# EAGLE schematic duckypad (EAGLE 9.6.2)
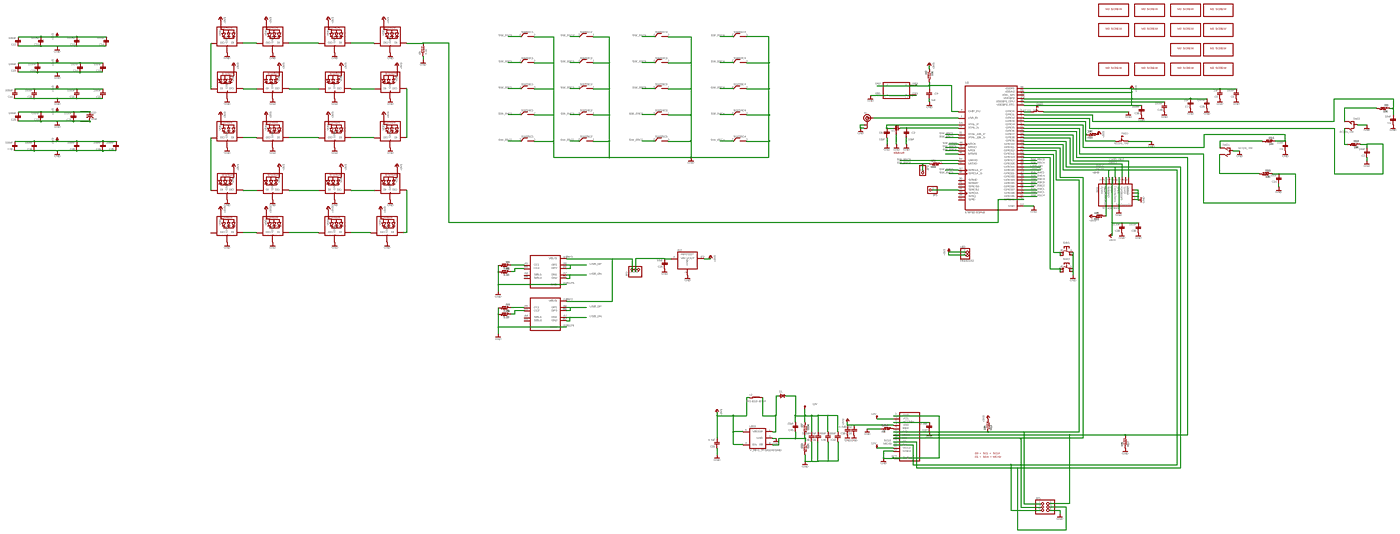
[diagram p0: schematic, sheet 1, overview]
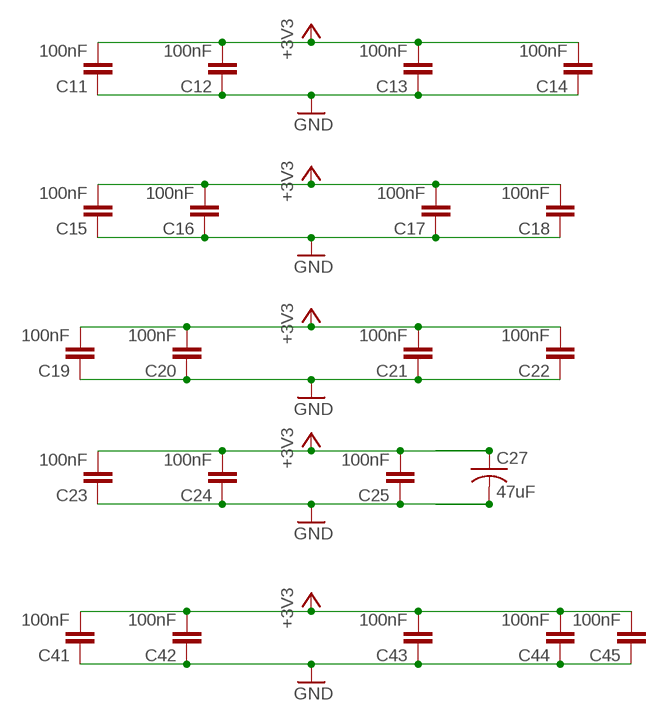
[diagram p1: schematic, sheet 1, part 1 of 4]
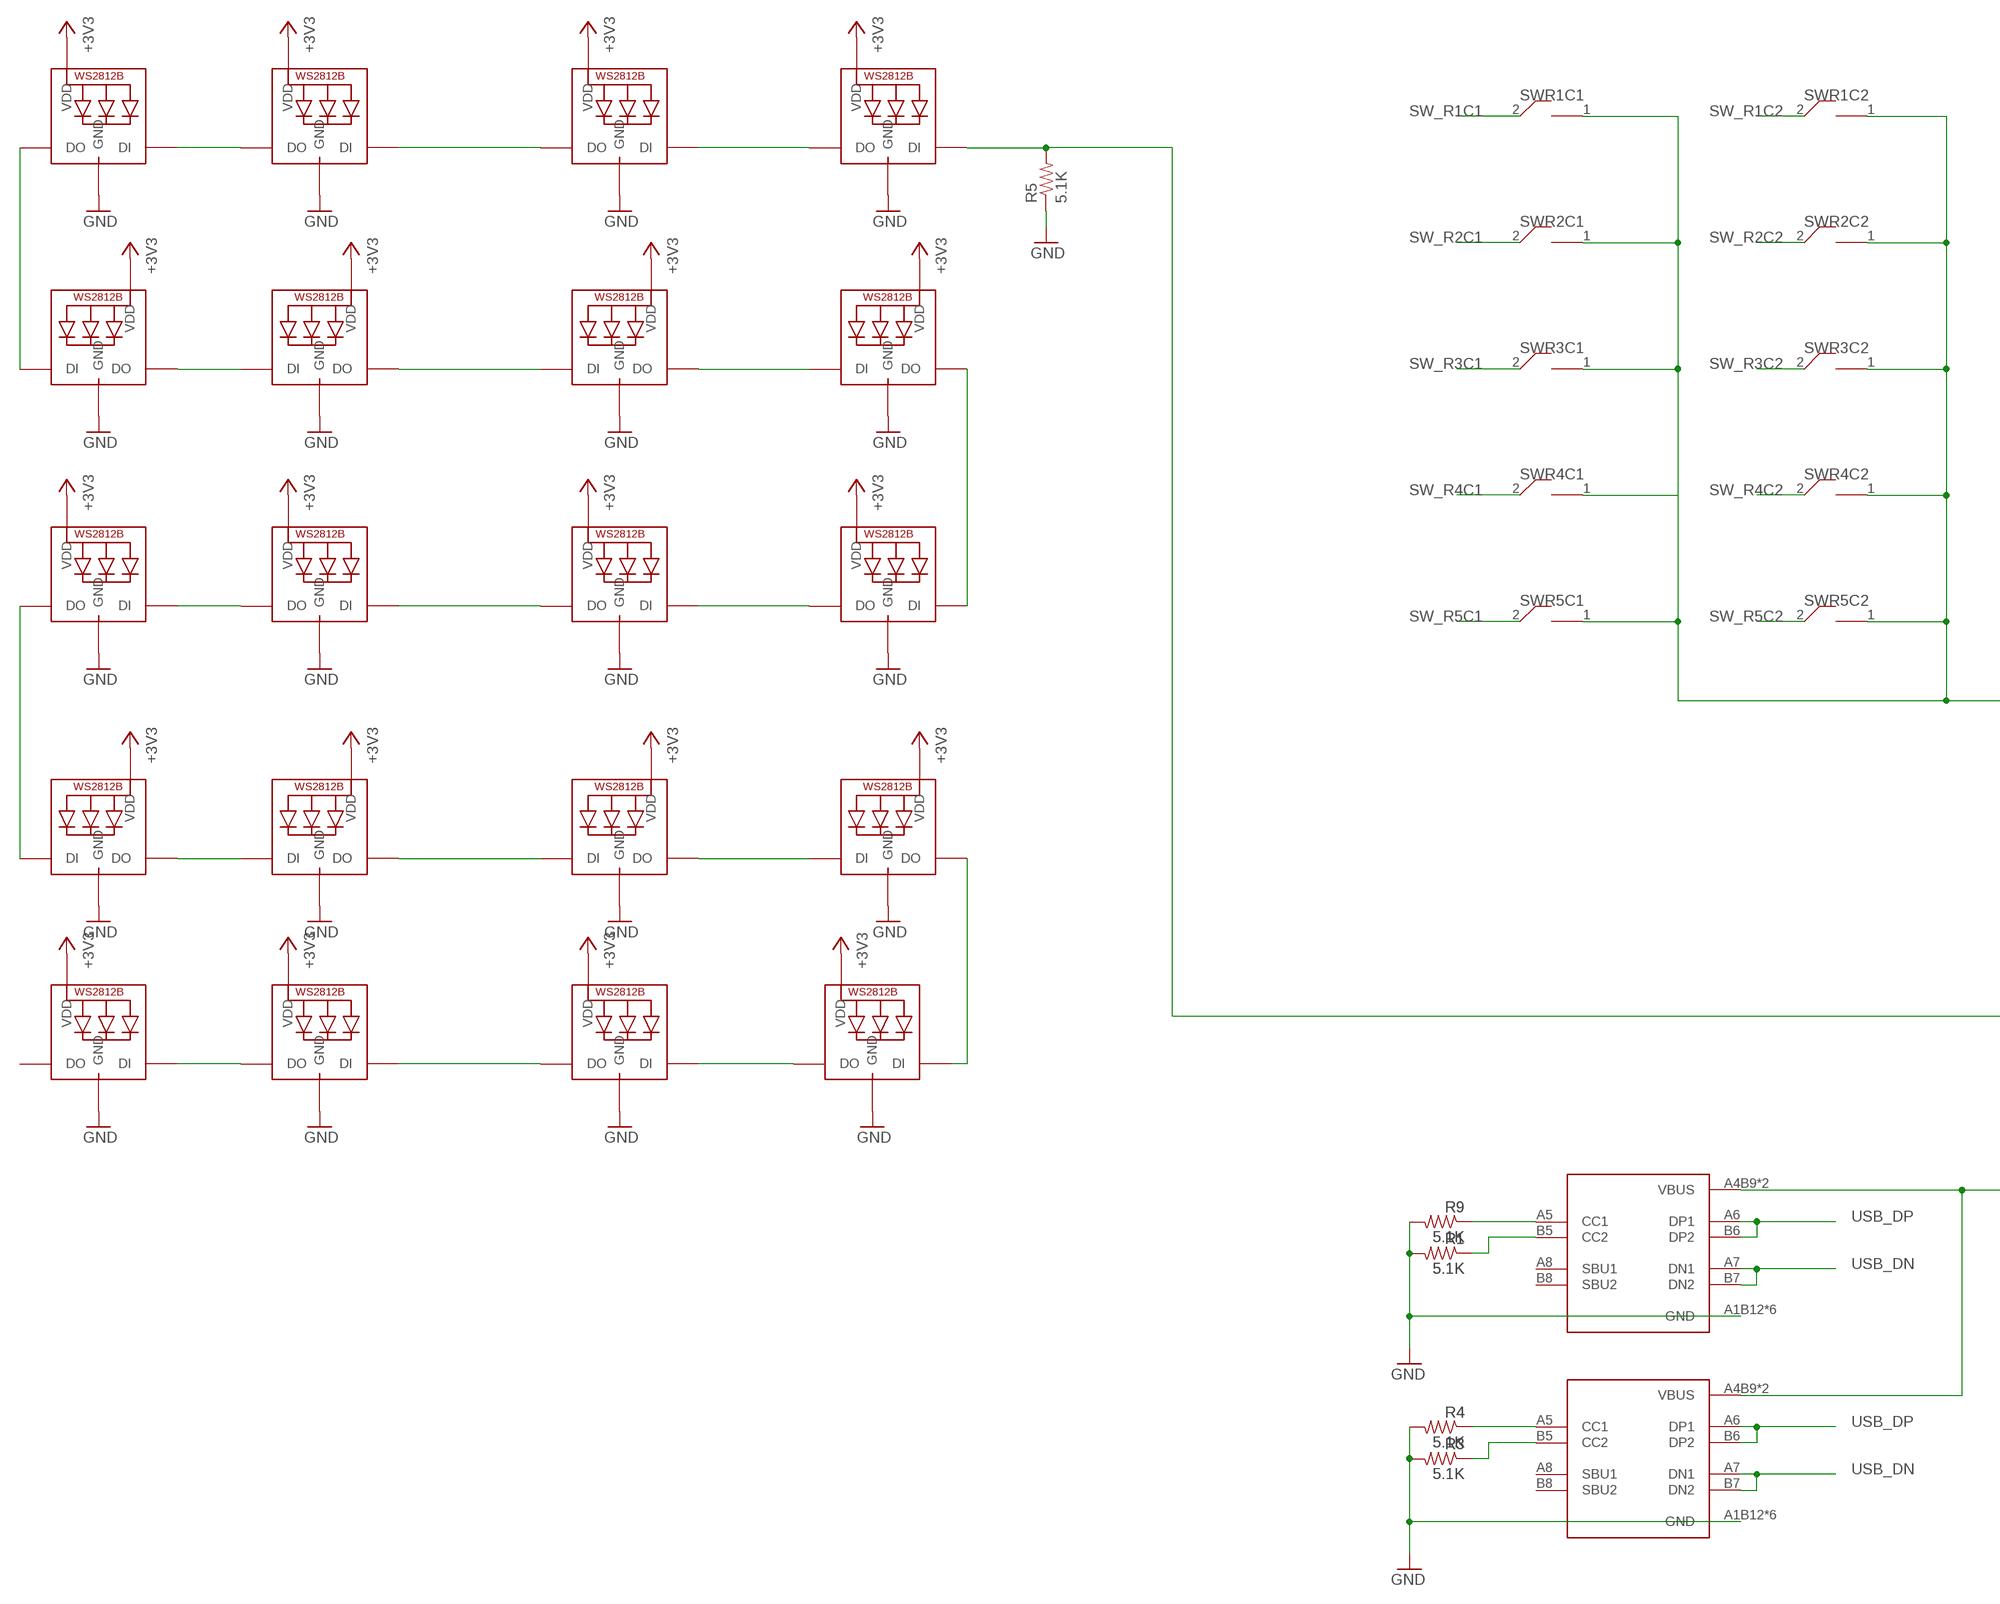
[diagram p2: schematic, sheet 1, part 2 of 4]
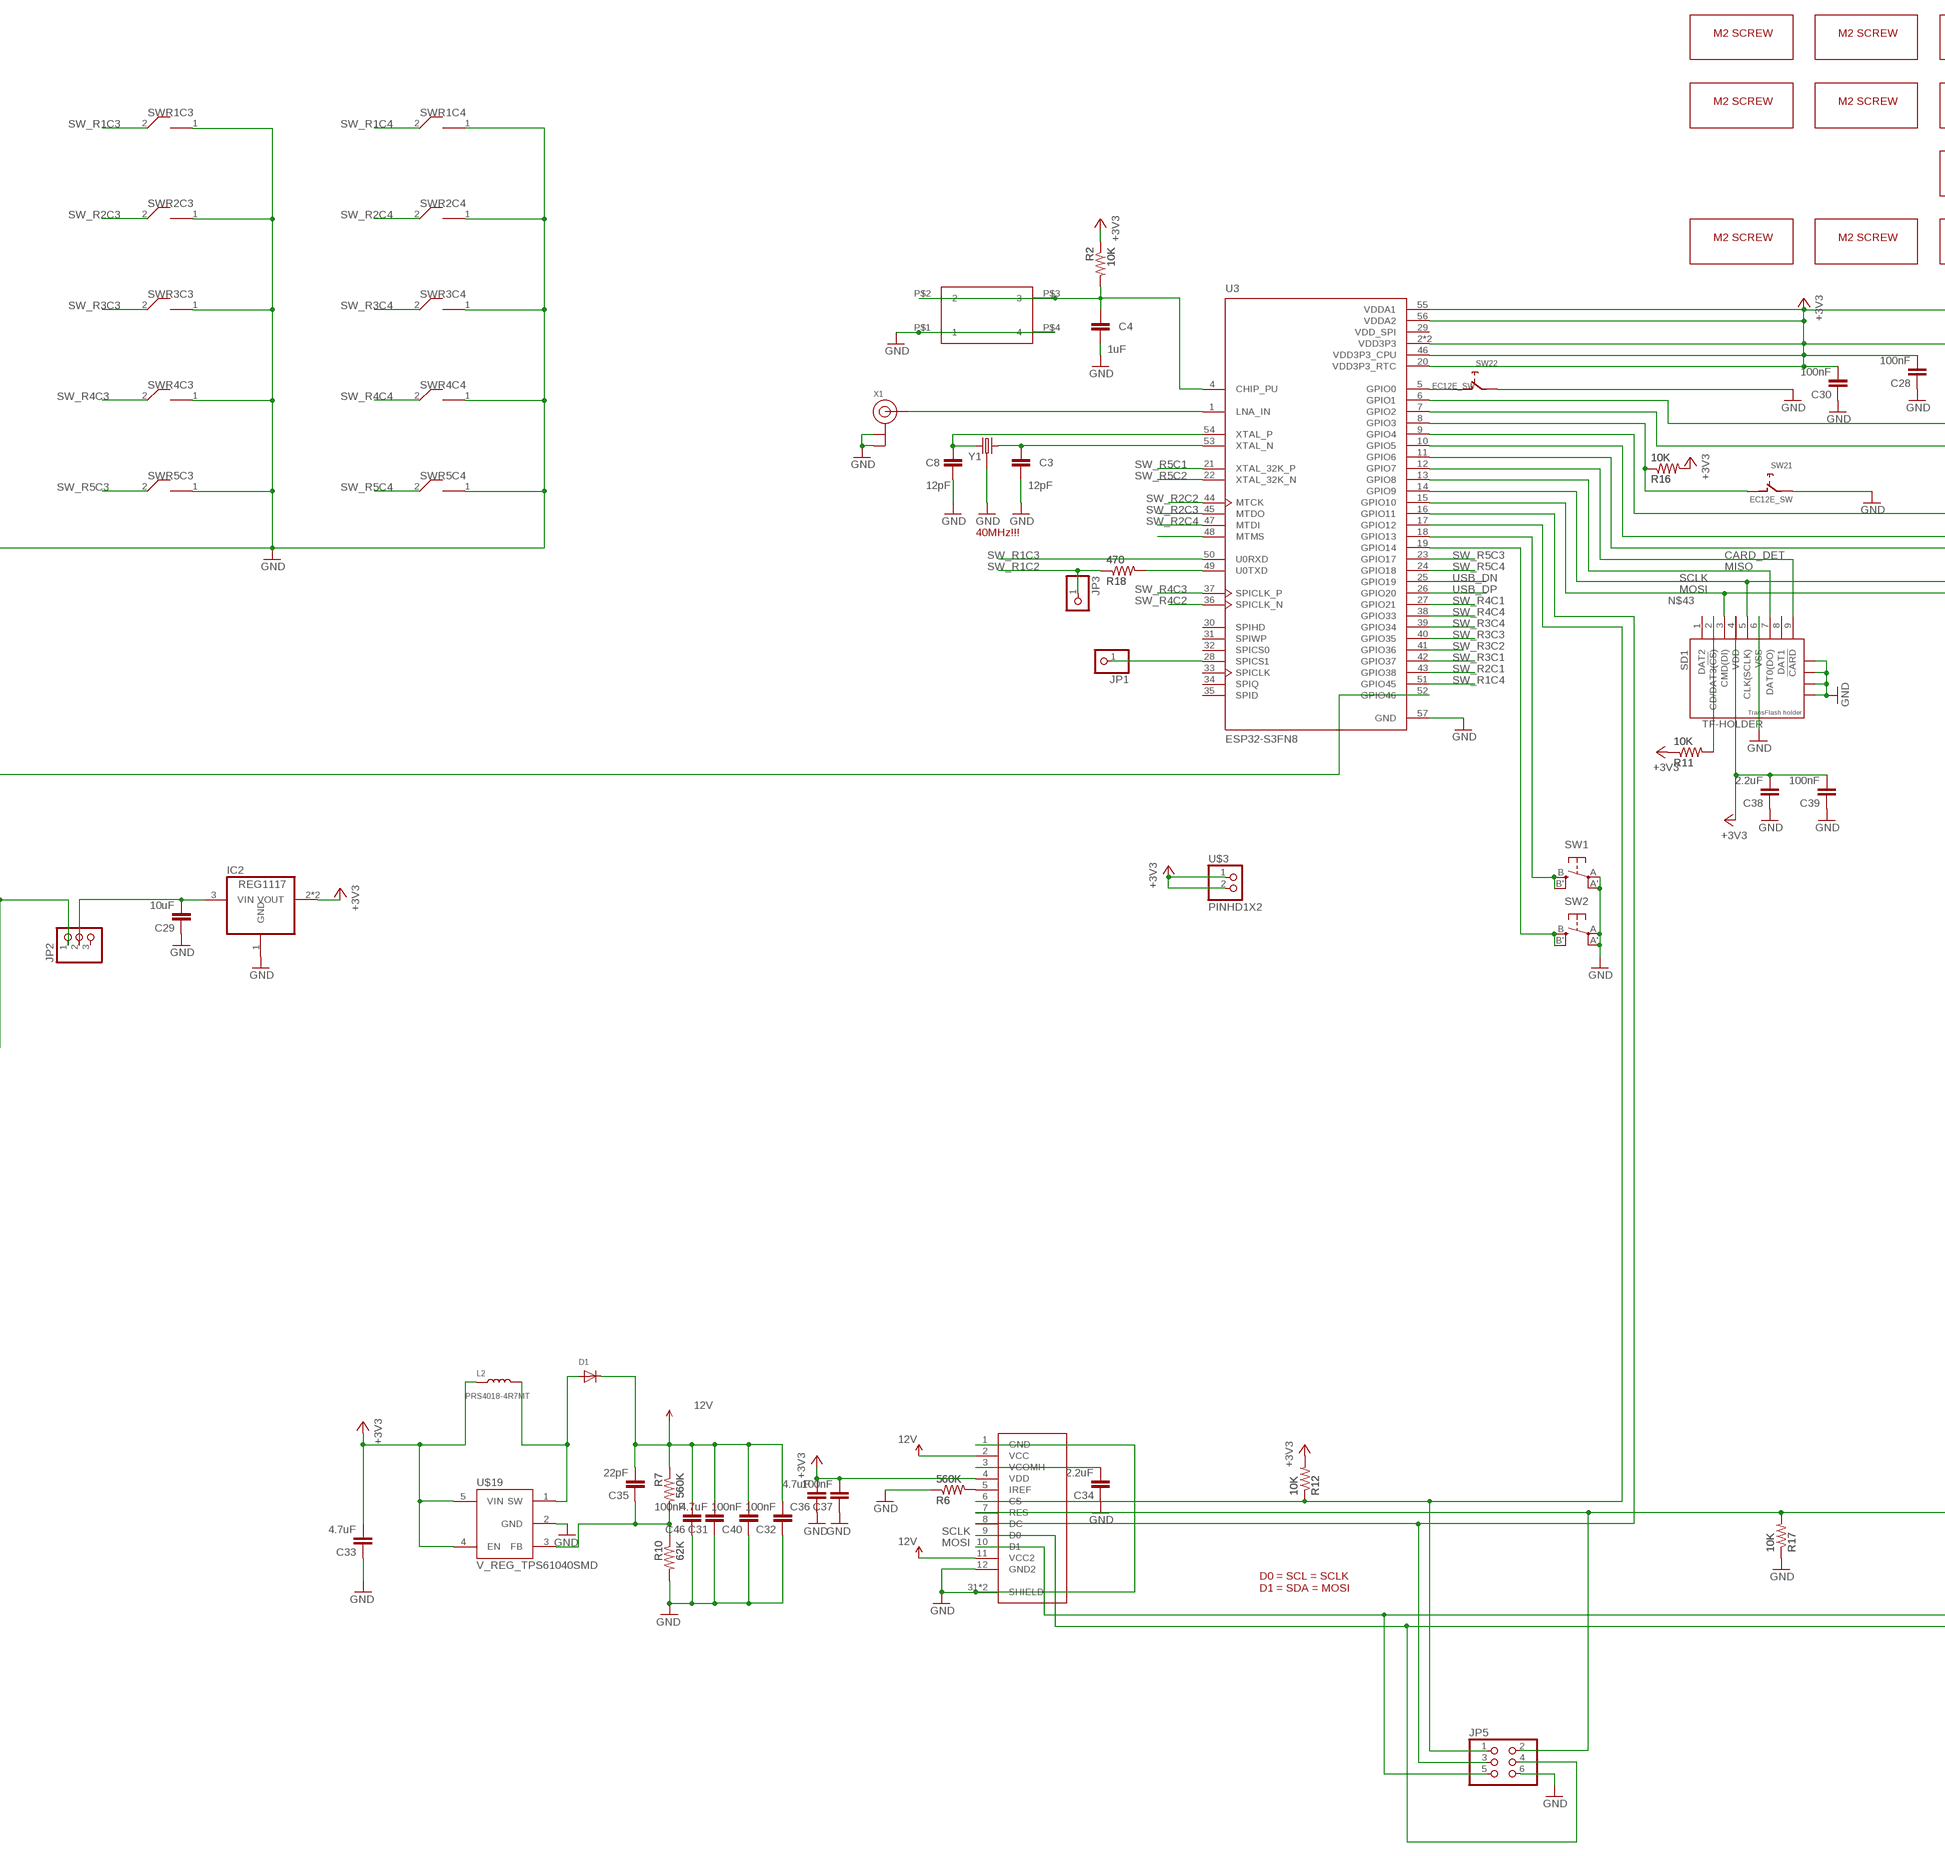
[diagram p3: schematic, sheet 1, part 3 of 4]
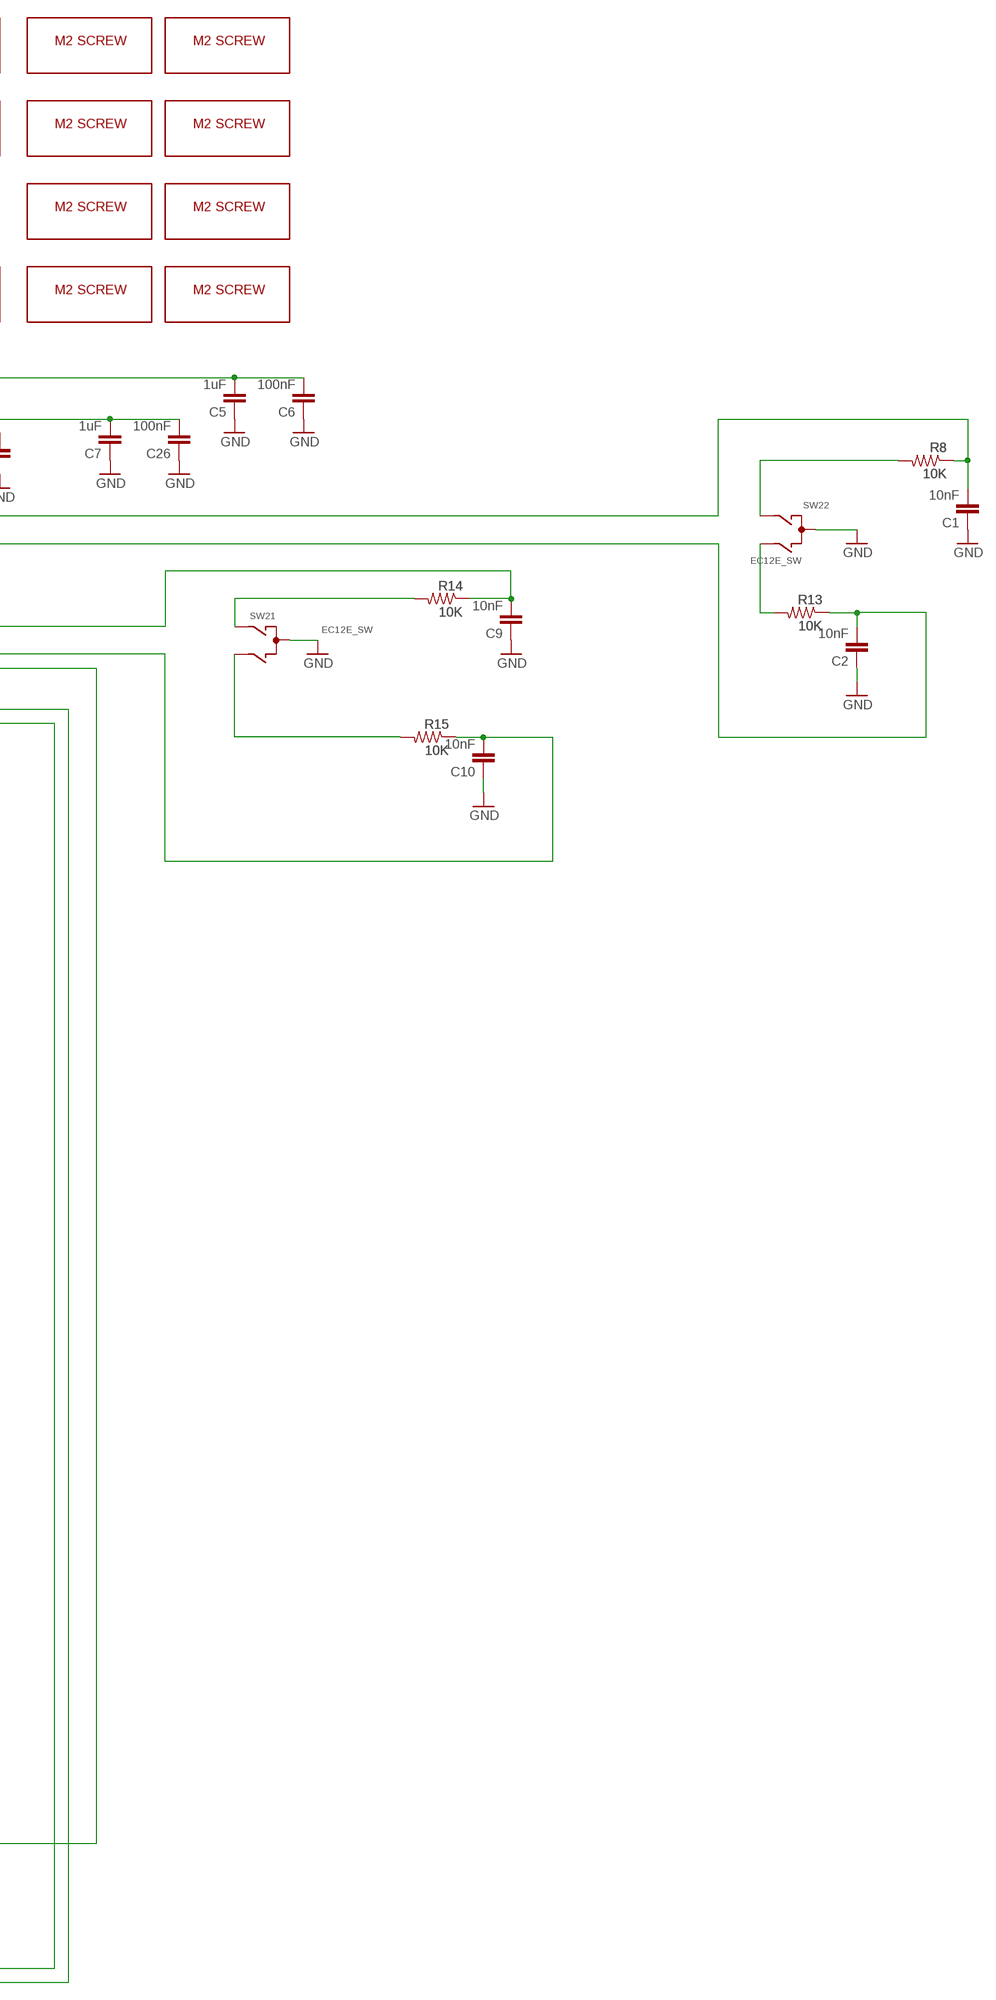
[diagram p4: schematic, sheet 1, part 4 of 4]

## Parts
C1  10nF  CAP0805  [0805]
C2  10nF  CAP0805  [0805]
C3  12pF  CAP0805  [0805]
C4  1uF  CAP0805  [0805]
C5  1uF  CAP0805  [0805]
C6  100nF  CAP0805  [0805]
C7  1uF  CAP0805  [0805]
C8  12pF  CAP0805  [0805]
C9  10nF  CAP0805  [0805]
C10  10nF  CAP0805  [0805]
C11  100nF  CAP0805  [0805]
C12  100nF  CAP0805  [0805]
C13  100nF  CAP0805  [0805]
C14  100nF  CAP0805  [0805]
C15  100nF  CAP0805  [0805]
C16  100nF  CAP0805  [0805]
C17  100nF  CAP0805  [0805]
C18  100nF  CAP0805  [0805]
C19  100nF  CAP0805  [0805]
C20  100nF  CAP0805  [0805]
C21  100nF  CAP0805  [0805]
C22  100nF  CAP0805  [0805]
C23  100nF  CAP0805  [0805]
C24  100nF  CAP0805  [0805]
C25  100nF  CAP0805  [0805]
C26  100nF  CAP0805  [0805]
C27  47uF  C-USC1210  [C1210]
C28  100nF  CAP0805  [0805]
C29  10uF  CAP0805  [0805]
C30  100nF  CAP0805  [0805]
C31  4.7uF  CAP0805  [0805]
C32  100nF  CAP0805  [0805]
C33  4.7uF  CAP0805  [0805]
C34  2.2uF  CAP0805  [0805]
C35  22pF  CAP0805  [0805]
C36  4.7uF  CAP0805  [0805]
C37  100nF  CAP0805  [0805]
C38  2.2uF  CAP0805  [0805]
C39  100nF  CAP0805  [0805]
C40  100nF  CAP0805  [0805]
C41  100nF  CAP0805  [0805]
C42  100nF  CAP0805  [0805]
C43  100nF  CAP0805  [0805]
C44  100nF  CAP0805  [0805]
C45  100nF  CAP0805  [0805]
C46  100nF  CAP0805  [0805]
D1  DIODESOD-123  [SOD-123]
IC2  REG1117  [SOT223]
JP1  PINHD-1X1CB  [1X01-CLEANBIG]
JP2  PINHD-1X3CB  [1X03-CLEANBIG]
JP3  PINHD-1X1CB  [1X01-CLEANBIG]
JP5  PINHD-2X3  [2X03]
L2  PRS4018-4R7MT  L-4030  [L4030]
LED_R1C1  WS2812B  [REVERSE_MNT]
LED_R1C2  WS2812B  [REVERSE_MNT]
LED_R1C3  WS2812B  [REVERSE_MNT]
LED_R1C4  WS2812B  [REVERSE_MNT]
LED_R2C1  WS2812B  [REVERSE_MNT]
LED_R2C2  WS2812B  [REVERSE_MNT]
LED_R2C3  WS2812B  [REVERSE_MNT]
LED_R2C4  WS2812B  [REVERSE_MNT]
LED_R3C1  WS2812B  [REVERSE_MNT]
LED_R3C2  WS2812B  [REVERSE_MNT]
LED_R3C3  WS2812B  [REVERSE_MNT]
LED_R3C4  WS2812B  [REVERSE_MNT]
LED_R4C1  WS2812B  [REVERSE_MNT]
LED_R4C2  WS2812B  [REVERSE_MNT]
LED_R4C3  WS2812B  [REVERSE_MNT]
LED_R4C4  WS2812B  [REVERSE_MNT]
LED_R5C1  WS2812B  [REVERSE_MNT]
LED_R5C2  WS2812B  [REVERSE_MNT]
LED_R5C3  WS2812B  [REVERSE_MNT]
LED_R5C4  WS2812B  [REVERSE_MNT]
R1  5.1K  RESISTOR0805-RES  [0805]
R2  10K  RESISTOR0805-RES  [0805]
R3  5.1K  RESISTOR0805-RES  [0805]
R4  5.1K  RESISTOR0805-RES  [0805]
R5  5.1K  RESISTOR0805-RES  [0805]
R6  560K  RESISTOR0805-RES  [0805]
R7  560K  RESISTOR0805-RES  [0805]
R8  10K  RESISTOR0805-RES  [0805]
R9  5.1K  RESISTOR0805-RES  [0805]
R10  62K  RESISTOR0805-RES  [0805]
R11  10K  RESISTOR0805-RES  [0805]
R12  10K  RESISTOR0805-RES  [0805]
R13  10K  RESISTOR0805-RES  [0805]
R14  10K  RESISTOR0805-RES  [0805]
R15  10K  RESISTOR0805-RES  [0805]
R16  10K  RESISTOR0805-RES  [0805]
R17  10K  RESISTOR0805-RES  [0805]
R18  470  RESISTOR0805-RES  [0805]
SD1  TF-HOLDER  [TF-PULL]
SW1  SPST_TACT-EVQQ2  [EVQ-Q2]
SW2  SPST_TACT-EVQQ2  [EVQ-Q2]
SW3  324_SW324_SWITCH_FOOT_HOLE  [342_SWICH_FOOT_HOLE]
SW21  EC12E_SW  [ALPS_EC12E_SW]
SW22  EC12E_SW  [ALPS_EC12E_SW]
SWR1C1  KAILH_SWITCH_SOCKET_KAILH_SWITCH_SOCKET  [KAILH_SWITCH_SOCKET_SWITCH_SOCKET]
SWR1C2  KAILH_SWITCH_SOCKET_KAILH_SWITCH_SOCKET  [KAILH_SWITCH_SOCKET_SWITCH_SOCKET]
SWR1C3  KAILH_SWITCH_SOCKET_KAILH_SWITCH_SOCKET  [KAILH_SWITCH_SOCKET_SWITCH_SOCKET]
SWR1C4  KAILH_SWITCH_SOCKET_KAILH_SWITCH_SOCKET  [KAILH_SWITCH_SOCKET_SWITCH_SOCKET]
SWR2C1  KAILH_SWITCH_SOCKET_KAILH_SWITCH_SOCKET  [KAILH_SWITCH_SOCKET_SWITCH_SOCKET]
SWR2C2  KAILH_SWITCH_SOCKET_KAILH_SWITCH_SOCKET  [KAILH_SWITCH_SOCKET_SWITCH_SOCKET]
SWR2C3  KAILH_SWITCH_SOCKET_KAILH_SWITCH_SOCKET  [KAILH_SWITCH_SOCKET_SWITCH_SOCKET]
SWR2C4  KAILH_SWITCH_SOCKET_KAILH_SWITCH_SOCKET  [KAILH_SWITCH_SOCKET_SWITCH_SOCKET]
SWR3C1  KAILH_SWITCH_SOCKET_KAILH_SWITCH_SOCKET  [KAILH_SWITCH_SOCKET_SWITCH_SOCKET]
SWR3C2  KAILH_SWITCH_SOCKET_KAILH_SWITCH_SOCKET  [KAILH_SWITCH_SOCKET_SWITCH_SOCKET]
SWR3C3  KAILH_SWITCH_SOCKET_KAILH_SWITCH_SOCKET  [KAILH_SWITCH_SOCKET_SWITCH_SOCKET]
SWR3C4  KAILH_SWITCH_SOCKET_KAILH_SWITCH_SOCKET  [KAILH_SWITCH_SOCKET_SWITCH_SOCKET]
SWR4C1  KAILH_SWITCH_SOCKET_KAILH_SWITCH_SOCKET  [KAILH_SWITCH_SOCKET_SWITCH_SOCKET]
SWR4C2  KAILH_SWITCH_SOCKET_KAILH_SWITCH_SOCKET  [KAILH_SWITCH_SOCKET_SWITCH_SOCKET]
SWR4C3  KAILH_SWITCH_SOCKET_KAILH_SWITCH_SOCKET  [KAILH_SWITCH_SOCKET_SWITCH_SOCKET]
SWR4C4  KAILH_SWITCH_SOCKET_KAILH_SWITCH_SOCKET  [KAILH_SWITCH_SOCKET_SWITCH_SOCKET]
SWR5C1  KAILH_SWITCH_SOCKET_KAILH_SWITCH_SOCKET  [KAILH_SWITCH_SOCKET_SWITCH_SOCKET]
SWR5C2  KAILH_SWITCH_SOCKET_KAILH_SWITCH_SOCKET  [KAILH_SWITCH_SOCKET_SWITCH_SOCKET]
SWR5C3  KAILH_SWITCH_SOCKET_KAILH_SWITCH_SOCKET  [KAILH_SWITCH_SOCKET_SWITCH_SOCKET]
SWR5C4  KAILH_SWITCH_SOCKET_KAILH_SWITCH_SOCKET  [KAILH_SWITCH_SOCKET_SWITCH_SOCKET]
U1  USBC_16P  [USBC_16P_FOOT]
U2  USBC_16P  [USBC_16P_FOOT]
U3  ESP32-S3FN8  [QFN40P700X700X90-57N]
U$2  OLED128  [LUL_UG-2864HSWEG01_1.3_WRAPAROUND]
U$3  PINHD1X2  [1X02]
U$7  M2_SCREW_DEV  [M2_SCREW_FOOT]
U$8  M2_SCREW_DEV  [M2_SCREW_FOOT]
U$9  M2_SCREW_DEV  [M2_SCREW_FOOT]
U$10  M2_SCREW_DEV  [M2_SCREW_FOOT]
U$11  M2_SCREW_DEV  [M2_SCREW_FOOT]
U$12  M2_SCREW_DEV  [M2_SCREW_FOOT]
U$13  M2_SCREW_DEV  [M2_SCREW_FOOT]
U$14  M2_SCREW_DEV  [M2_SCREW_FOOT]
U$15  M2_SCREW_DEV  [M2_SCREW_FOOT]
U$16  M2_SCREW_DEV  [M2_SCREW_FOOT]
U$17  M2_SCREW_DEV  [M2_SCREW_FOOT]
U$19  V_REG_TPS61040SMD  [SOT23-5]
U$20  M2_SCREW_DEV  [M2_SCREW_FOOT]
U$21  M2_SCREW_DEV  [M2_SCREW_FOOT]
U$22  M2_SCREW_DEV  [M2_SCREW_FOOT]
X1  ANTENNA_U.FL  [U.FL]
Y1  16MHz_12pF  CRYSTAL-26MHZSMD-3.2X2.5  [CRYSTAL-SMD-3.2X2.5MM]

## Nets
12V: C31.2 C32.2 C35.2 C40.2 C46.2 D1.C R7.1 U$2.2(VCC) U$2.11(VCC2)
+3V3: C5.2 C6.2 C7.2 C11.2 C12.2 C13.2 C14.2 C15.2 C16.2 C17.2 C18.2 C19.2 C20.2 C21.2 C22.2 C23.2 C24.2 C25.2 C26.2 C27.1 C28.2 C30.2 C33.2 C36.2 C37.2 C38.2 C39.2 C41.2 C42.2 C43.2 C44.2 C45.2 IC2.2(VOUT) IC2.4(VOUT) L2.1 LED_R1C1.VDD LED_R1C2.VDD LED_R1C3.VDD LED_R1C4.VDD LED_R2C1.VDD LED_R2C2.VDD LED_R2C3.VDD LED_R2C4.VDD LED_R3C1.VDD LED_R3C2.VDD LED_R3C3.VDD LED_R3C4.VDD LED_R4C1.VDD LED_R4C2.VDD LED_R4C3.VDD LED_R4C4.VDD LED_R5C1.VDD LED_R5C2.VDD LED_R5C3.VDD LED_R5C4.VDD R2.1 R11.1 R12.2 R16.2 SD1.4(VDD) U3.2(VDD3P3) U3.3(VDD3P3) U3.20(VDD3P3_RTC) U3.46(VDD3P3_CPU) U3.55(VDDA1) U3.56(VDDA2) U$2.4(VDD) U$3.1 U$3.2 U$19.4(EN) U$19.5(VIN)
CARD_DET: SD1.9(!CARD) U3.12(GPIO7)
DC: JP5.3 U3.16(GPIO11) U$2.8(DC)
GND: C1.1 C2.1 C3.2 C4.2 C5.1 C6.1 C7.1 C8.2 C9.1 C10.1 C11.1 C12.1 C13.1 C14.1 C15.1 C16.1 C17.1 C18.1 C19.1 C20.1 C21.1 C22.1 C23.1 C24.1 C25.1 C26.1 C27.2 C28.1 C29.1 C30.1 C31.1 C32.1 C33.1 C34.1 C36.1 C37.1 C38.1 C39.1 C40.1 C41.1 C42.1 C43.1 C44.1 C45.1 C46.1 IC2.1(GND) JP5.6 LED_R1C1.GND LED_R1C2.GND LED_R1C3.GND LED_R1C4.GND LED_R2C1.GND LED_R2C2.GND LED_R2C3.GND LED_R2C4.GND LED_R3C1.GND LED_R3C2.GND LED_R3C3.GND LED_R3C4.GND LED_R4C1.GND LED_R4C2.GND LED_R4C3.GND LED_R4C4.GND LED_R5C1.GND LED_R5C2.GND LED_R5C3.GND LED_R5C4.GND R1.2 R3.2 R4.2 R5.1 R6.1 R9.2 R10.2 R17.1 SD1.6(VSS) SD1.S1 SD1.S2 SD1.S3 SD1.S4 SW1.A'(P1) SW1.A(P) SW2.A'(P1) SW2.A(P) SW3.P$1 SW3.P$4 SW21.C SW21.E SW22.C SW22.E SWR1C1.1 SWR1C2.1 SWR1C3.1 SWR1C4.1 SWR2C1.1 SWR2C2.1 SWR2C3.1 SWR2C4.1 SWR3C1.1 SWR3C2.1 SWR3C3.1 SWR3C4.1 SWR4C1.1 SWR4C2.1 SWR4C3.1 SWR4C4.1 SWR5C1.1 SWR5C2.1 SWR5C3.1 SWR5C4.1 U1.A1B12(GND) U1.B11A12(GND) U1.P$13(GND) U1.P$14(GND) U1.P$15(GND) U1.P$16(GND) U2.A1B12(GND) U2.B11A12(GND) U2.P$13(GND) U2.P$14(GND) U2.P$15(GND) U2.P$16(GND) U3.57(GND) U$2.1(GND) U$2.12(GND2) U$2.31(SHIELD) U$2.32(SHIELD) U$19.2(GND) X1.1(GND) X1.2(GND) Y1.2 Y1.4
MISO: SD1.7(DAT0(DO)) U3.13(GPIO8)
MOSI: JP5.5 SD1.3(CMD(DI)) U3.15(GPIO10) U$2.10(D1)
N$1: JP2.1 U1.A4B9(VBUS) U1.B4A9(VBUS) U2.A4B9(VBUS) U2.B4A9(VBUS)
N$2: LED_R1C3.DIN(DI) LED_R1C4.DOUT(DO)
N$3: LED_R1C2.DIN(DI) LED_R1C3.DOUT(DO)
N$4: LED_R1C1.DIN(DI) LED_R1C2.DOUT(DO)
N$5: LED_R1C1.DOUT(DO) LED_R2C1.DIN(DI)
N$6: LED_R2C1.DOUT(DO) LED_R2C2.DIN(DI)
N$7: LED_R2C2.DOUT(DO) LED_R2C3.DIN(DI)
N$8: C34.2 U$2.3(VCOMH)
N$9: LED_R2C3.DOUT(DO) LED_R2C4.DIN(DI)
N$10: R6.2 U$2.5(IREF)
N$11: LED_R2C4.DOUT(DO) LED_R3C4.DIN(DI)
N$12: LED_R3C3.DIN(DI) LED_R3C4.DOUT(DO)
N$13: LED_R3C2.DIN(DI) LED_R3C3.DOUT(DO)
N$14: C9.2 R14.1 U3.9(GPIO4)
N$15: LED_R3C1.DIN(DI) LED_R3C2.DOUT(DO)
N$16: LED_R3C1.DOUT(DO) LED_R4C1.DIN(DI)
N$17: LED_R4C1.DOUT(DO) LED_R4C2.DIN(DI)
N$18: LED_R4C2.DOUT(DO) LED_R4C3.DIN(DI)
N$19: LED_R4C3.DOUT(DO) LED_R4C4.DIN(DI)
N$20: LED_R4C4.DOUT(DO) LED_R5C4.DIN(DI)
N$21: LED_R5C3.DIN(DI) LED_R5C4.DOUT(DO)
N$22: LED_R5C2.DIN(DI) LED_R5C3.DOUT(DO)
N$23: LED_R5C1.DIN(DI) LED_R5C2.DOUT(DO)
N$24: C8.1 U3.54(XTAL_P) Y1.1
N$25: C3.1 U3.53(XTAL_N) Y1.3
N$26: U3.1(LNA_IN) X1.3(SIGNAL)
N$27: JP1.1 U3.28(SPICS1)
N$28: R3.1 U1.B5(CC2)
N$29: LED_R1C4.DIN(DI) R5.2 U3.52(GPIO46)
N$30: R4.1 U1.A5(CC1)
N$31: R1.1 U2.B5(CC2)
N$32: C29.2 IC2.3(VIN) JP2.2
N$33: R9.1 U2.A5(CC1)
N$34: R8.2 SW22.A
N$35: R13.2 SW22.B
N$36: D1.A L2.2 U$19.1(SW)
N$37: SW22.D U3.5(GPIO0)
N$38: C1.2 R8.1 U3.6(GPIO1)
N$39: C35.1 R7.2 R10.1 U$19.3(FB)
N$40: C2.2 R13.1 U3.7(GPIO2)
N$41: R16.1 SW21.D U3.8(GPIO3)
N$42: R15.2 SW21.B
N$43: R11.2 SD1.2(CD/DAT3(!CS!))
N$44: R18.2 U3.49(U0TXD)
N$46: SW1.B'(S1) SW1.B(S) U3.18(GPIO13)
N$47: SW2.B'(S1) SW2.B(S) U3.19(GPIO14)
N$48: R14.2 SW21.A
N$49: C10.2 R15.1 U3.10(GPIO5)
OLED_CS: JP5.1 R12.1 U3.17(GPIO12) U$2.6(CS)
OLED_RESET: JP5.2 R17.2 U3.11(GPIO6) U$2.7(RES)
RESET: C4.1 R2.2 SW3.P$2 SW3.P$3 U3.4(CHIP_PU)
SCLK: JP5.4 SD1.5(CLK(SCLK)) U3.14(GPIO9) U$2.9(D0)
SW_R1C1: SWR1C1.2 U3.48(MTMS)
SW_R1C2: JP3.1 R18.1 SWR1C2.2
SW_R1C3: SWR1C3.2 U3.50(U0RXD)
SW_R1C4: SWR1C4.2 U3.51(GPIO45)
SW_R2C1: SWR2C1.2 U3.43(GPIO38)
SW_R2C2: SWR2C2.2 U3.44(MTCK)
SW_R2C3: SWR2C3.2 U3.45(MTDO)
SW_R2C4: SWR2C4.2 U3.47(MTDI)
SW_R3C1: SWR3C1.2 U3.42(GPIO37)
SW_R3C2: SWR3C2.2 U3.41(GPIO36)
SW_R3C3: SWR3C3.2 U3.40(GPIO35)
SW_R3C4: SWR3C4.2 U3.39(GPIO34)
SW_R4C1: SWR4C1.2 U3.27(GPIO21)
SW_R4C2: SWR4C2.2 U3.36(SPICLK_N)
SW_R4C3: SWR4C3.2 U3.37(SPICLK_P)
SW_R4C4: SWR4C4.2 U3.38(GPIO33)
SW_R5C1: SWR5C1.2 U3.21(XTAL_32K_P)
SW_R5C2: SWR5C2.2 U3.22(XTAL_32K_N)
SW_R5C3: SWR5C3.2 U3.23(GPIO17)
SW_R5C4: SWR5C4.2 U3.24(GPIO18)
USB_DN: U1.A7(DN1) U1.B7(DN2) U2.A7(DN1) U2.B7(DN2) U3.25(GPIO19)
USB_DP: U1.A6(DP1) U1.B6(DP2) U2.A6(DP1) U2.B6(DP2) U3.26(GPIO20)
Unconnected: JP2.3 LED_R5C1.DOUT(DO) SD1.1(DAT2) SD1.8(DAT1) SW21.GND1(G) SW21.GND2(G) SW22.GND1(G) SW22.GND2(G) U1.A8(SBU1) U1.B8(SBU2) U2.A8(SBU1) U2.B8(SBU2) U3.30(SPIHD) U3.31(SPIWP) U3.32(SPICS0) U3.33(SPICLK) U3.34(SPIQ) U3.35(SPID)

## Notes on the sheet
- 40MHz!!!
- D0 = SCL = SCLK
  D1 = SDA = MOSI

## Power pins joined to a net without a drawn wire
VDD_SPI: U3.29(VDD_SPI)

## Library data of the parts
C1-C26 C28-C46 = clock:CAP: Capacitor Standard 0603 ceramic capacitor, and 0.1" leaded capacitor.
C27 = clock:C-US: CAPACITOR, American symbol
D1 = adafruit_changed:DIODE: Diode SMADIODE - SMA Surface Mount Package 20V 1A Schottky Diode Digikey: 641-1014-6-ND DO-1N4148 - Through Hole Small Current Diode SOD-123 20V 1 A (.5mV Vf) Schottky Diode - Digikey: MBRX120TPMSCT-ND SOD-323 10V 570mA (.38mV Vf, 3ns) Schottky Diode - Digikey: ZLLS410CT-ND SOD-523 30V 30mA Schottky Diode (RB751S-40TE61) - Digikey: RB751S-40TE61CT-ND SOT23-R/W - SOT23 Package (R = Solder Paste/Reflow Ovens, W = Hand-Soldering) BAT54Film 40V 300mA - Digikey: 497-7162-1-ND
IC2 = clock:REG1117: 800mA and 1A Low Dropout (LDO) Positive Regulator 1.8V, 2.5V, 2.85V, 3.3V, 5V, and Adj; MPN: REG1117; OC_FARNELL: 1097566; OC_NEWARK: 14P6981
JP1 JP3 = adafruit_changed:PINHD-1X1: Pin header 1x1 for 0.1" spacing With round pins
JP2 = adafruit_changed:PINHD-1X3: PIN HEADER
JP5 = pinhead:PINHD-2X3: PIN HEADER
L2 = Discrete:L*
LED_R1C1-LED_R1C4 LED_R2C1-LED_R2C4 LED_R3C1-LED_R3C4 LED_R4C1-LED_R4C4 LED_R5C1-LED_R5C4 = duckypad:WS2812B
R1-R4 R6-R18 = joyAnalog:RESISTOR: Resistor Basic schematic elements and footprints for 0603, 1206, and PTH resistors.
R5 = clock:RESISTOR: Resistor Basic schematic elements and footprints for 0603, 1206, and PTH resistors.
SD1 = clock:TF-HOLDER: TF / Micro SD socket is PUSH-PUSH type, the card can be pushed into and auto locked and pushed out by simply press the card. Surface Mounting type.
SW1 SW2 = adafruit_changed:SPST_TACT: SMT 6mm switch, EVQQ2 series http://www.ladyada.net/library/eagle
SW3 = 3pos_slide_switch:324_SW
SW21 SW22 = switch-alps:EC12E_SW: ALPS rotary Encoder EC12E series with switch; MPN: EC12E2424407; OC_FARNELL: 1520813; OC_NEWARK: 74M1068
SWR1C1-SWR1C4 SWR2C1-SWR2C4 SWR3C1-SWR3C4 SWR4C1-SWR4C4 SWR5C1-SWR5C4 = lul:KAILH_SWITCH_SOCKET_KAILH_SWITCH_SOCKET
U1 U2 = my_usbc_16p:USBC_16P
U3 = ESP32-S3FN8:ESP32-S3FN8: Check availability <https://pricing.snapeda.com/parts/ESP32-S3FN8/Espressif%20Systems/view-part?ref=eda> Check availability <https://pricing.snapeda.com/parts/ESP32-S3FN8/Espressif%20Systems/view-part?ref=eda> Check availability <https://pricing.snapeda.com/parts/ESP32-S3FN8/Espressif%20Systems/view-part?ref=eda>; AVAILABILITY: In Stock; CHECK_PRICES: https://www.snapeda.com/parts/ESP32-S3FN8/Espressif+Systems/view-part/?ref=eda; DESCRIPTION: Espressif Systems [ENGINEERING SAMPLES]SMD IC , Dual-Core MCU, Wi-Fi 2.4G & BLE 5.0 combo, 8 MB Octal SPI PSRAM, QFN 56-pin, 7*7 mm; MF: Espressif Systems; MP: ESP32-S3FN8; PACKAGE: None; PRICE: None; SNAPEDA_LINK: https://www.snapeda.com/parts/ESP32-S3FN8/Espressif+Systems/view-part/?ref=snap
U$2 = oled:OLED128
U$3 = adafruit_changed:PINHD1X2
U$7-U$17 U$20-U$22 = duckypad:M2_SCREW_DEV
U$19 = SparkFun-Retired:V_REG_TPS61040
X1 = adafruit_changed:ANTENNA_U.FL: U.FL Antenna Connector
Y1 = SparkFun-Clocks:CRYSTAL-26MHZ: 26MHz Crystal w/ Ground Pin Digikey Example <http://www.digikey.com/product-detail/en/epson/TSX-3225%2026.0000MF09Z-AC3/SER3627CT-ND/1802878> Frequency: 26MHz Frequency Stability: ±9ppm Frequency Tolerance: ±10ppm Load Capacitance: 9pF SparkFun Products: SparkFun ESP32 Thing <https://www.sparkfun.com/products/13907> SparkFun ESP8266 Thing Dev Board <https://www.sparkfun.com/products/13711>; PROD_ID: XTAL-12454